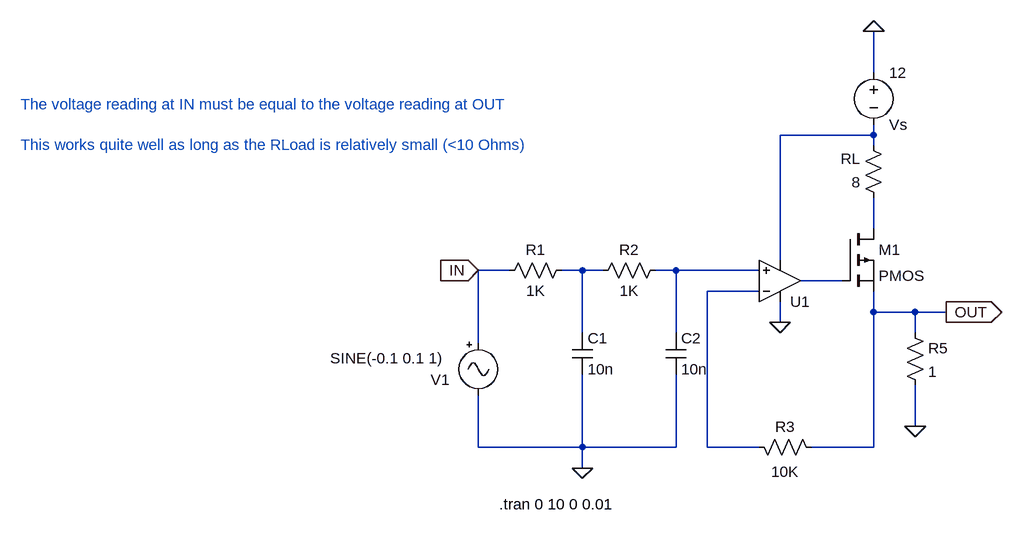
[diagram p0: schematic with_pmos.asc]
with_pmos.asc, the LTspice schematic file:
Version 4
SHEET 1 880 680
WIRE 272 -144 272 -208
WIRE 272 -48 272 -64
WIRE 272 -48 128 -48
WIRE 272 -32 272 -48
WIRE 272 96 272 48
WIRE 128 144 128 -48
WIRE -288 160 -336 160
WIRE -176 160 -208 160
WIRE -144 160 -176 160
WIRE -32 160 -64 160
WIRE 96 160 -32 160
WIRE 224 176 160 176
WIRE 96 192 16 192
WIRE 272 224 272 192
WIRE 336 224 272 224
WIRE 384 224 336 224
WIRE 128 240 128 208
WIRE -176 256 -176 160
WIRE -32 256 -32 160
WIRE 336 256 336 224
WIRE -336 272 -336 160
WIRE 336 400 336 336
WIRE -336 432 -336 352
WIRE -176 432 -176 320
WIRE -176 432 -336 432
WIRE -32 432 -32 320
WIRE -32 432 -176 432
WIRE 16 432 16 192
WIRE 96 432 16 432
WIRE 272 432 272 224
WIRE 272 432 176 432
WIRE -176 464 -176 432
FLAG 272 -208 0
FLAG -176 464 0
FLAG 336 400 0
FLAG 128 240 0
FLAG -336 160 IN
IOPIN -336 160 In
FLAG 384 224 OUT
IOPIN 384 224 Out
SYMBOL res 288 64 R180
WINDOW 0 36 76 Left 2
WINDOW 3 36 40 Left 2
SYMATTR InstName RL
SYMATTR Value 8
SYMBOL res 320 240 R0
SYMATTR InstName R5
SYMATTR Value 1
SYMBOL res -192 144 R90
WINDOW 0 0 56 VBottom 2
WINDOW 3 32 56 VTop 2
SYMATTR InstName R1
SYMATTR Value 1K
SYMBOL voltage 272 -160 R0
WINDOW 0 24 96 Left 2
WINDOW 3 24 16 Left 2
WINDOW 123 0 0 Left 0
WINDOW 39 0 0 Left 0
SYMATTR InstName Vs
SYMATTR Value 12
SYMBOL cap -192 256 R0
SYMATTR InstName C1
SYMATTR Value 10n
SYMBOL res -48 144 R90
WINDOW 0 0 56 VBottom 2
WINDOW 3 32 56 VTop 2
SYMATTR InstName R2
SYMATTR Value 1K
SYMBOL cap -48 256 R0
SYMATTR InstName C2
SYMATTR Value 10n
SYMBOL OpAmps\\UniversalOpAmp 128 176 M180
SYMATTR InstName U1
SYMBOL pmos 224 96 R0
SYMATTR InstName M1
SYMBOL Misc\\signal -336 256 R0
WINDOW 123 0 0 Left 0
WINDOW 39 0 0 Left 0
WINDOW 0 -73 72 Left 2
WINDOW 3 -228 39 Left 2
SYMATTR InstName V1
SYMATTR Value SINE(-0.1 0.1 1)
SYMBOL res 80 416 M90
WINDOW 0 0 56 VBottom 2
WINDOW 3 38 56 VTop 2
SYMATTR InstName R3
SYMATTR Value 10K
TEXT -304 520 Left 2 !.tran 0 10 0 0.01
TEXT -1040 -96 Left 2 ;The voltage reading at IN must be equal to the voltage reading at OUT\n \nThis works quite well as long as the RLoad is relatively small (<10 Ohms)

The netlist it stands for:
* with_pmos.asc
RL N002 N001 8
R5 OUT 0 1
R1 N003 IN 1K
Vs 0 N001 12
C1 N003 0 10n
R2 N004 N003 1K
C2 N004 0 10n
XU1 N004 N006 0 N001 N005 level1 Avol=1Meg GBW=10Meg Vos=0 En=0 Enk=0 In=0 Ink=0 Rin=500Meg  ; pins In+ In- V+ V- OUT
M1 N002 N005 OUT OUT PMOS
V1 IN 0 SINE(-0.1 0.1 1)
R3 N006 OUT 10K
.model NMOS NMOS
.model PMOS PMOS
.lib standard.mos
.tran 0 10 0 0.01
* The voltage reading at IN must be equal to the voltage reading at OUT
* This works quite well as long as the RLoad is relatively small (<10 Ohms)
.lib UniversalOpAmp1.lib
.backanno
.end